# EAGLE design GlacTracker (EAGLE 9.6.2)

## Sheet 1 of 2
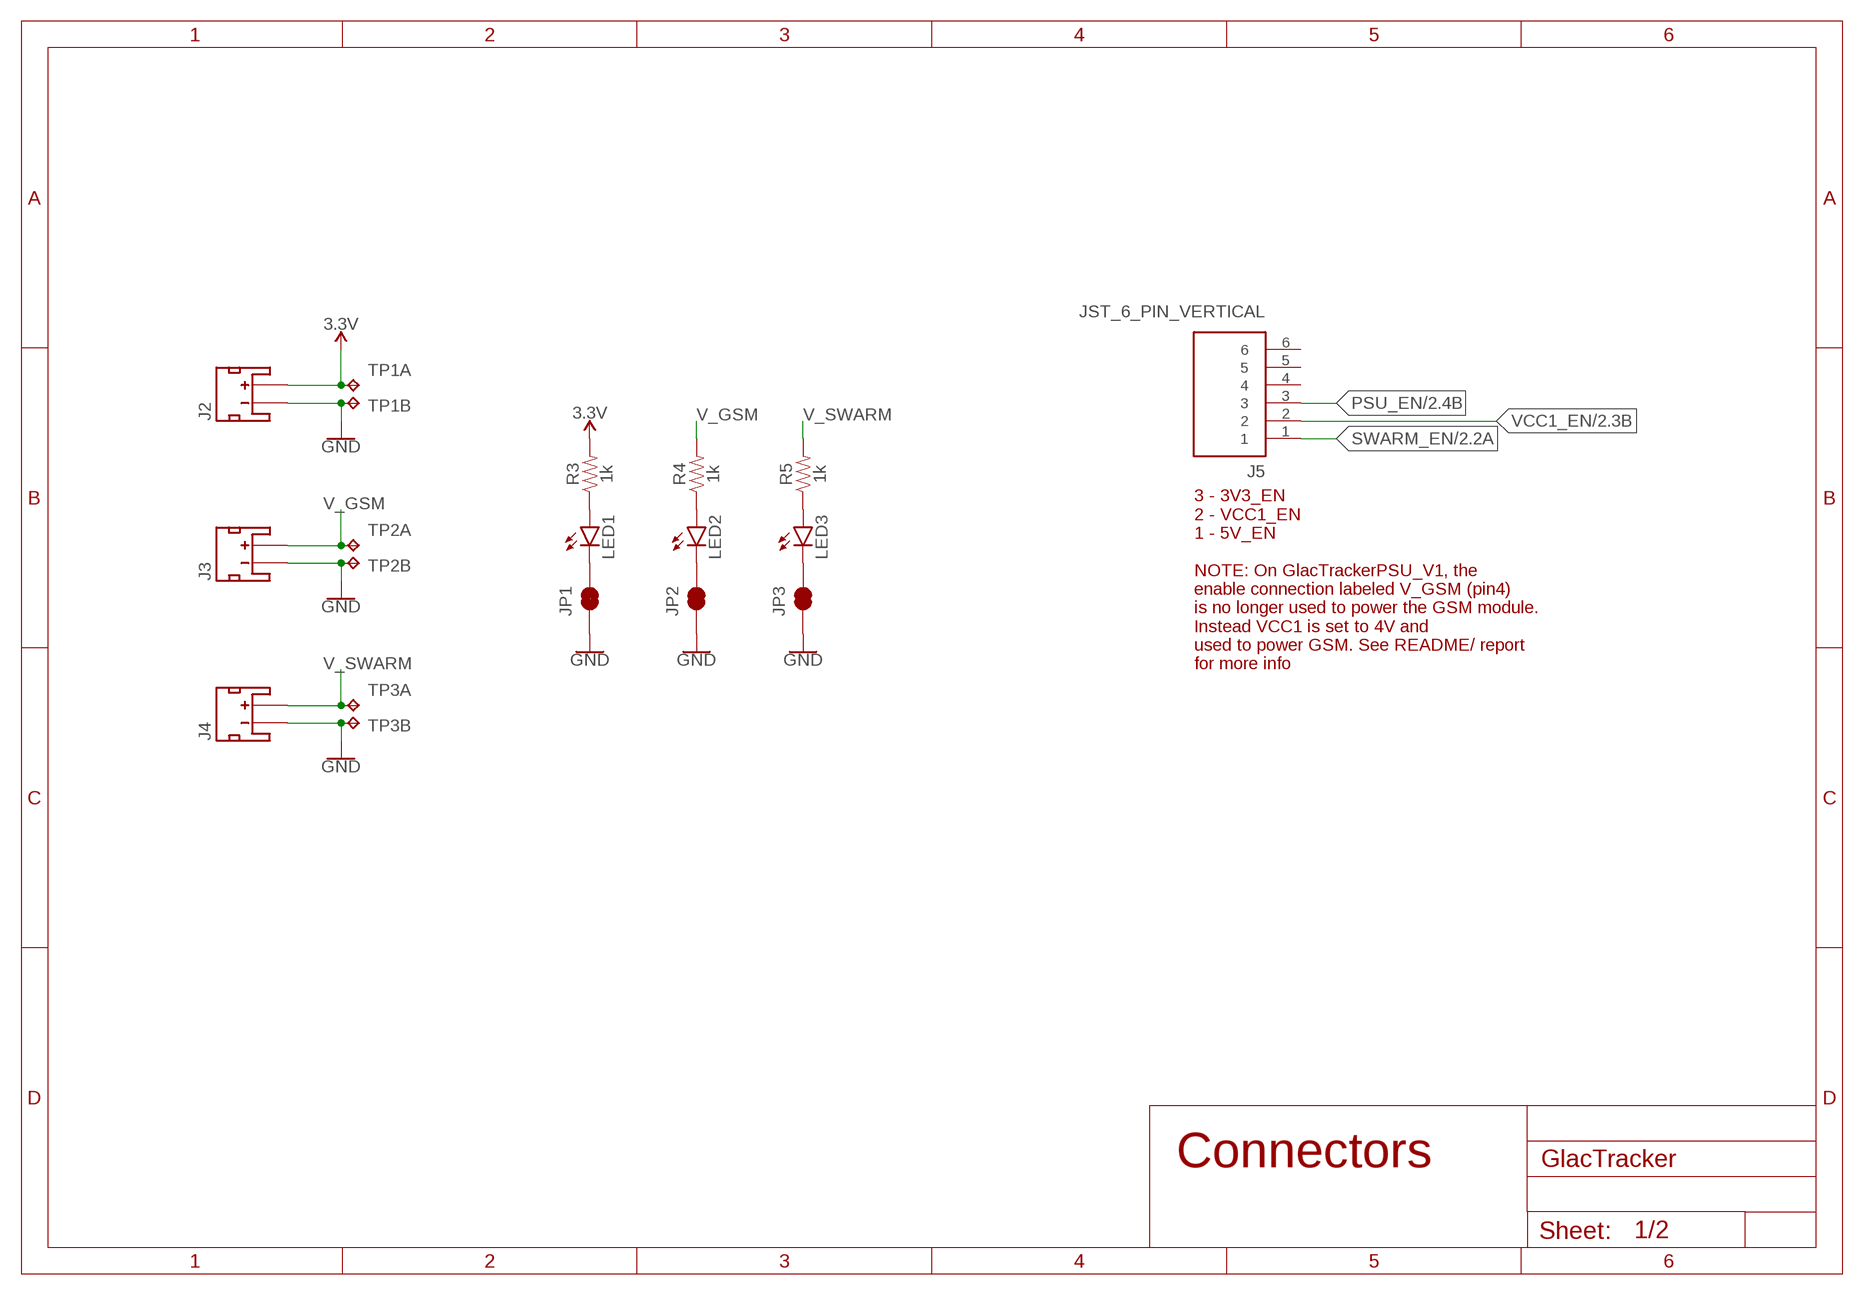
[diagram p0: schematic, sheet 1]

### Parts
J2  JST_2MM_MALE  [JST-2-SMD]
J3  JST_2MM_MALE  [JST-2-SMD]
J4  JST_2MM_MALE  [JST-2-SMD]
J5  JST_6_PIN_VERTICAL  [JST-6-SMD-VERT-1.0MM]
JP1  JUMPER-SMT_2_NC_TRACE_SILK  [SMT-JUMPER_2_NC_TRACE_SILK]
JP2  JUMPER-SMT_2_NC_TRACE_SILK  [SMT-JUMPER_2_NC_TRACE_SILK]
JP3  JUMPER-SMT_2_NC_TRACE_SILK  [SMT-JUMPER_2_NC_TRACE_SILK]
LED1  LEDCHIP-LED0805  [CHIP-LED0805]
LED2  LEDCHIP-LED0805  [CHIP-LED0805]
LED3  LEDCHIP-LED0805  [CHIP-LED0805]
R3  1k  RESISTOR0603  [0603]
R4  1k  RESISTOR0603  [0603]
R5  1k  RESISTOR0603  [0603]
TP1  TP2P2-38-17  [P2-38-17]
TP2  TP2P2-38-17  [P2-38-17]
TP3  TP2P2-38-17  [P2-38-17]

### Nets
3.3V: J2.2(+) R3.2 TP1.TP-1 ; also sheet 2
GND: J2.1(-) J3.1(-) J4.1(-) JP1.1 JP2.1 JP3.1 TP1.TP-2 TP2.TP-2 TP3.TP-2 ; also sheet 2
N$6: JP1.2 LED1.C
N$7: JP2.2 LED2.C
N$8: JP3.2 LED3.C
N$13: LED1.A R3.1
N$14: LED2.A R4.1
N$15: LED3.A R5.1
PSU_EN: J5.3 ; also sheet 2
SWARM_EN: J5.1 ; also sheet 2
V_GSM: J3.2(+) R4.2 TP2.TP-1 ; also sheet 2
V_SWARM: J4.2(+) R5.2 TP3.TP-1 ; also sheet 2
VCC1_EN: J5.2 ; also sheet 2
Unconnected: J2.NC1(PAD1) J2.NC2(PAD2) J3.NC1(PAD1) J3.NC2(PAD2) J4.NC1(PAD1) J4.NC2(PAD2) J5.4 J5.5 J5.6

### Notes on the sheet
- 3 - 3V3_EN
  2 - VCC1_EN
  1 - 5V_EN
  
  NOTE: On GlacTrackerPSU_V1, the 
  enable connection labeled V_GSM (pin4)
  is no longer used to power the GSM module.
  Instead VCC1 is set to 4V and 
  used to power GSM. See README/ report 
  for more info
- Connectors

## Sheet 2 of 2
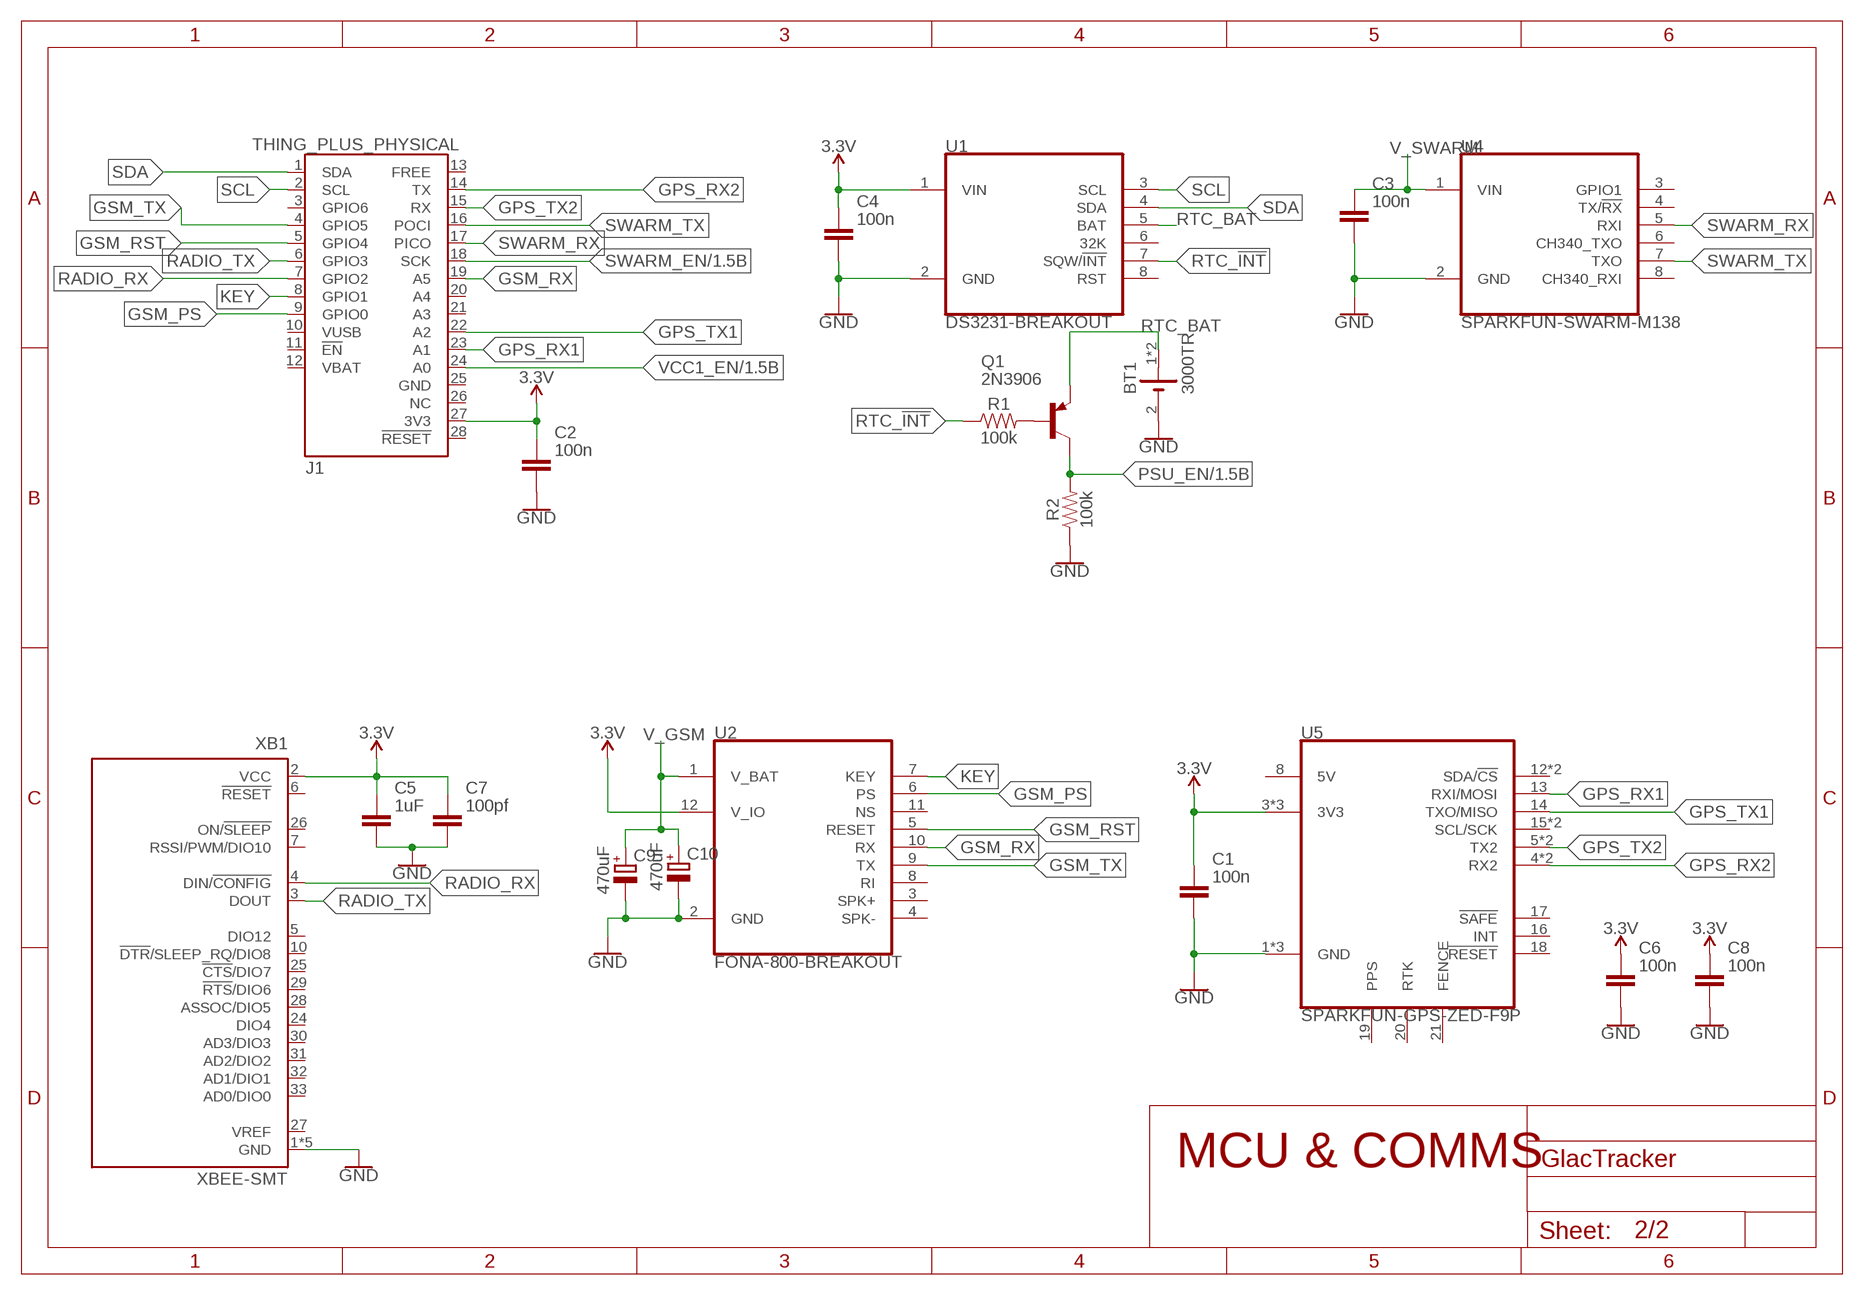
[diagram p1: schematic, sheet 2]

### Parts
BT1  3000TR  [BAT_3000TR]
C1  100n  C_CHIP-0603(1608-METRIC)  [CAPC1608X85]
C2  100n  C_CHIP-0603(1608-METRIC)  [CAPC1608X85]
C3  100n  C_CHIP-0603(1608-METRIC)  [CAPC1608X85]
C4  100n  C_CHIP-0603(1608-METRIC)  [CAPC1608X85]
C5  1uF  C_CHIP-0603(1608-METRIC)  [CAPC1608X85]
C6  100n  C_CHIP-0603(1608-METRIC)  [CAPC1608X85]
C7  100pf  C_CHIP-0603(1608-METRIC)  [CAPC1608X85]
C8  100n  C_CHIP-0603(1608-METRIC)  [CAPC1608X85]
C9  470uF  C-POL_RADIAL-11MM-DIA  [CAPPRD508W65D1000H1100B]
C10  470uF  C-POL_RADIAL-11MM-DIA  [CAPPRD508W65D1000H1100B]
J1  THING_PLUS_PHYSICAL  [THING_PLUS]
Q1  2N3906  [TO92]
R1  100k  RESISTOR0603  [0603]
R2  100k  RESISTOR0603  [0603]
U1  DS3231-BREAKOUT  [DS3231-BREAKOUT]
U2  FONA-800-BREAKOUT  [FONA-800-BREAKOUT]
U4  SPARKFUN-SWARM-M138  [SPARKFUN-SWARM-M138]
U5  SPARKFUN-GPS-ZED-F9P  [SPARKFUN-GPS-ZED-F9P]
XB1  XBEE-SMT  [XBEE-SMT]

### Nets
3.3V: C1.1 C2.1 C4.1 C5.1 C6.1 C7.1 C8.1 J1.27(3V3) U1.1(VIN) U2.12(V_IO) U5.3(3V3) U5.9(3V3) U5.24(3V3) XB1.2(VCC) ; also sheet 1
GND: BT1.2(-) C1.2 C2.2 C3.2 C4.2 C5.2 C6.2 C7.2 C8.2 C9.2(-) C10.2(-) R2.1 U1.2(GND) U2.2(GND) U4.2(GND) U5.1(GND) U5.7(GND) U5.25(GND) XB1.1(GND) XB1.11(GND) XB1.13(GND) XB1.22(GND) XB1.35(GND) ; also sheet 1
GPS_RX1: J1.23(A1) U5.13(RXI/MOSI)
GPS_RX2: J1.14(TX) U5.4(RX2) U5.11(RX2)
GPS_TX1: J1.22(A2) U5.14(TXO/MISO)
GPS_TX2: J1.15(RX) U5.5(TX2) U5.10(TX2)
GSM_PS: J1.9(GPIO0) U2.6(PS)
GSM_RST: J1.5(GPIO4) U2.5(RESET)
GSM_RX: J1.19(A5) U2.10(RX)
GSM_TX: J1.4(GPIO5) U2.9(TX)
KEY: J1.8(GPIO1) U2.7(KEY)
N$1: Q1.2(B) R1.2
PSU_EN: Q1.1(C) R2.2 ; also sheet 1
RADIO_RX: J1.7(GPIO2) XB1.4(DIN/!CONFIG)
RADIO_TX: J1.6(GPIO3) XB1.3(DOUT)
RTC_!INT: R1.1 U1.7(SQW/!INT)
RTC_BAT: BT1.1(+) BT1.3(+) Q1.3(E) U1.5(BAT)
SCL: J1.2(SCL) U1.3(SCL)
SDA: J1.1(SDA) U1.4(SDA)
SWARM_EN: J1.18(SCK) ; also sheet 1
SWARM_RX: J1.17(PICO) U4.5(RXI)
SWARM_TX: J1.16(POCI) U4.7(TXO)
V_GSM: C9.1(+) C10.1(+) U2.1(V_BAT) ; also sheet 1
V_SWARM: C3.1 U4.1(VIN) ; also sheet 1
VCC1_EN: J1.24(A0) ; also sheet 1
Unconnected: J1.3(GPIO6) J1.10(VUSB) J1.11(!EN) J1.12(VBAT) J1.13(FREE) J1.20(A4) J1.21(A3) J1.25(GND) J1.26(NC) J1.28(!RESET) U1.6(32K) U1.8(RST) U2.3(SPK+) U2.4(SPK-) U2.8(RI) U2.11(NS) U4.3(GPIO1) U4.4(TX/!RX) U4.6(CH340_TXO) U4.8(CH340_RXI) U5.8(5V) U5.12(SDA/!CS) U5.15(SCL/SCK) U5.16(INT) U5.17(!SAFE) U5.18(!RESET) U5.19(PPS) U5.20(RTK) U5.21(FENCE) U5.22(SCL/SCK) U5.23(SDA/!CS) XB1.5(DIO12) XB1.6(!RESET) XB1.7(RSSI/PWM/DIO10) XB1.10(!DTR!/SLEEP_RQ/DIO8) XB1.24(DIO4) XB1.25(!CTS!/DIO7) XB1.26(ON/!SLEEP) XB1.27(VREF) XB1.28(ASSOC/DIO5) XB1.29(!RTS!/DIO6) XB1.30(AD3/DIO3) XB1.31(AD2/DIO2) XB1.32(AD1/DIO1) XB1.33(AD0/DIO0)

### Notes on the sheet
- MCU & COMMS

## Library data of the parts
BT1 = 3000TR:3000TR: Ultra Low Profile SMT Coin Cell Battery Contact Retainer for 12 mm Cell Check availability <https://pricing.snapeda.com/parts/3000TR/Keystone/view-part?ref=eda>; AVAILABILITY: In Stock; DESCRIPTION: SMT Holder for 12mm Cell-Tin Nickel Plate on T&R; MF: Keystone; MP: 3000TR; PACKAGE: None; PRICE: None; PURCHASE-URL: https://pricing.snapeda.com/search/part/3000TR/?ref=eda
C1-C8 = Capacitor:C: Capacitor - Generic; CATEGORY: Capacitor
C9 C10 = Capacitor:C-POL: Capacitor Polarised - Generic; CATEGORY: Capacitor
J1 = SparkFun-Boards:THING_PLUS_PHYSICAL
J2-J4 = SparkFun-Connectors:JST_2MM_MALE: JST 2MM MALE RA CONNECTOR Two pin, compact surface mount connector. Commonly used as a battery input connection point. We really like the solid locking feeling and high current rating on these small connectors. We use these all the time as battery connectors. Mates to single-cell LiPo batteries. Here is the connector we sell at SparkFun: JST Right Angle Connector - White <https://www.sparkfun.com/products/8612> (PRT-08612) Datasheet <http://www.sparkfun.com/datasheets/Prototyping/Connectors/JST-Horizontal.pdf> It was used on these SparkFun products: SparkFun MOSFET Power Controller <https://www.sparkfun.com/products/11214> (PRT-11214) SparkFun Battery Babysitter - LiPo Battery Manager <https://www.sparkfun.com/products/13777> (PRT-13777) And many, many others that required a lipo battery connection.; PROD_ID: CONN-11443; SF_ID: PRT-08612
J5 = SparkFun-Connectors:JST_6_PIN_VERTICAL: JST 6 pin vertical connector Here is a six pin vertical 1.0mm pitch connector. It is useful if you need something very tiny as a connection. These are not the standard JST type connectors we use on most of our boards, but are actually the much smaller JST-SH type. Here is the connector we sell at SparkFun: JST SH Vertical 6-Pin Connector - SMD <https://www.sparkfun.com/products/579> (GPS-00579) Datasheet <http://www.sparkfun.com/datasheets/GPS/EM406-SMDConnector-eSH.pdf> It was used on these SparkFun products: SparkFun GPS Breakout <https://www.sparkfun.com/products/11818> (BOB-11818) SparkFun Weather Shield <https://www.sparkfun.com/products/12081> (DEV-12081) And many, many other GPS related products.; PROD_ID: CONN-08249; SF_ID: GPS-00579
JP1-JP3 = SparkFun-Jumpers:JUMPER-SMT_2_NC_TRACE: Normally closed trace jumper This jumper has a trace between two pads so it's normally closed (NC). Use a razor knife to open the connection. For best results follow the IPC guidelines for cutting traces: Cutout at least 0.063 mm (0.005 in). Remove all loose material to clean up the cut area. Seal the cut with an approved epoxy. Reapply solder to reclose the connection.
LED1-LED3 = led:LED: LED OSRAM: - CHIPLED LG R971, LG N971, LY N971, LG Q971, LY Q971, LO R971, LY R971 LH N974, LH R974 LS Q976, LO Q976, LY Q976 LO Q996 - Hyper CHIPLED LW Q18S LB Q993, LB Q99A, LB R99A - SideLED LS A670, LO A670, LY A670, LG A670, LP A670 LB A673, LV A673, LT A673, LW A673 LH A674 LY A675 LS A676, LA A676, LO A676, LY A676, LW A676 LS A679, LY A679, LG A679 - Hyper Micro SIDELED® LS Y876, LA Y876, LO Y876, LY Y876 LT Y87S - SmartLED LW L88C, LW L88S LB L89C, LB L89S, LG L890 LS L89K, LO L89K, LY L89K LS L896, LA L896, LO L896, LY L896 - TOPLED LS T670, LO T670, LY T670, LG T670, LP T670 LSG T670, LSP T670, LSY T670, LOP T670, LYG T670 LG T671, LOG T671, LSG T671 LB T673, LV T673, LT T673, LW T673 LH T674 LS T676, LA T676, LO T676, LY T676, LB T676, LH T676, LSB T676, LW T676 LB T67C, LV T67C, LT T67C, LS T67K, LO T67K, LY T67K, LW E67C LS E67B, LA E67B, LO E67B, LY E67B, LB E67C, LV E67C, LT E67C LW T67C LS T679, LY T679, LG T679 LS T770, LO T770, LY T770, LG T770, LP T770 LB T773, LV T773, LT T773, LW T773 LH T774 LS E675, LA E675, LY E675, LS T675 LS T776, LA T776, LO T776, LY T776, LB T776 LHGB T686 LT T68C, LB T68C - Hyper Mini TOPLED® LB M676 - Mini TOPLED Santana® LG M470 LS M47K, LO M47K, LY M47K Source: http://www.osram.convergy.de LUXEON: - LUMILED® LXK2-PW12-R00, LXK2-PW12-S00, LXK2-PW14-U00, LXK2-PW14-V00 LXK2-PM12-R00, LXK2-PM12-S00, LXK2-PM14-U00 LXK2-PE12-Q00, LXK2-PE12-R00, LXK2-PE12-S00, LXK2-PE14-T00, LXK2-PE14-U00 LXK2-PB12-K00, LXK2-PB12-L00, LXK2-PB12-M00, LXK2-PB14-N00, LXK2-PB14-P00, LXK2-PB14-Q00 LXK2-PR12-L00, LXK2-PR12-M00, LXK2-PR14-Q00, LXK2-PR14-R00 LXK2-PD12-Q00, LXK2-PD12-R00, LXK2-PD12-S00 LXK2-PH12-R00, LXK2-PH12-S00 LXK2-PL12-P00, LXK2-PL12-Q00, LXK2-PL12-R00 Source: www.luxeon.com KINGBRIGHT: KA-3528ASYC Source: www.kingbright.com
Q1 = transistor-pnp:2N3906: PNP Transistor
R1-R5 = SparkFun-Resistors:RESISTOR: Generic Resistor Package
TP1-TP3 = testpad:TP2: Test pad
U1 = GlacTracker:DS3231-BREAKOUT
U2 = GlacTracker:FONA-800-BREAKOUT
U4 = GlacTracker:SPARKFUN-SWARM-M138
U5 = GlacTracker:SPARKFUN-GPS-ZED-F9P
XB1 = xbee:XBEE-SMT: XBee(TM)/XBee-PRO(TM) ZB SMT RF Modules. Source: Digi (90002002_a.pdf) (http://www.digi.com/products/wireless-wired-embedded-solutions/zigbee-rf-modules/zigbee-mesh-module/xbee-smt.jsp#overview)

## Board
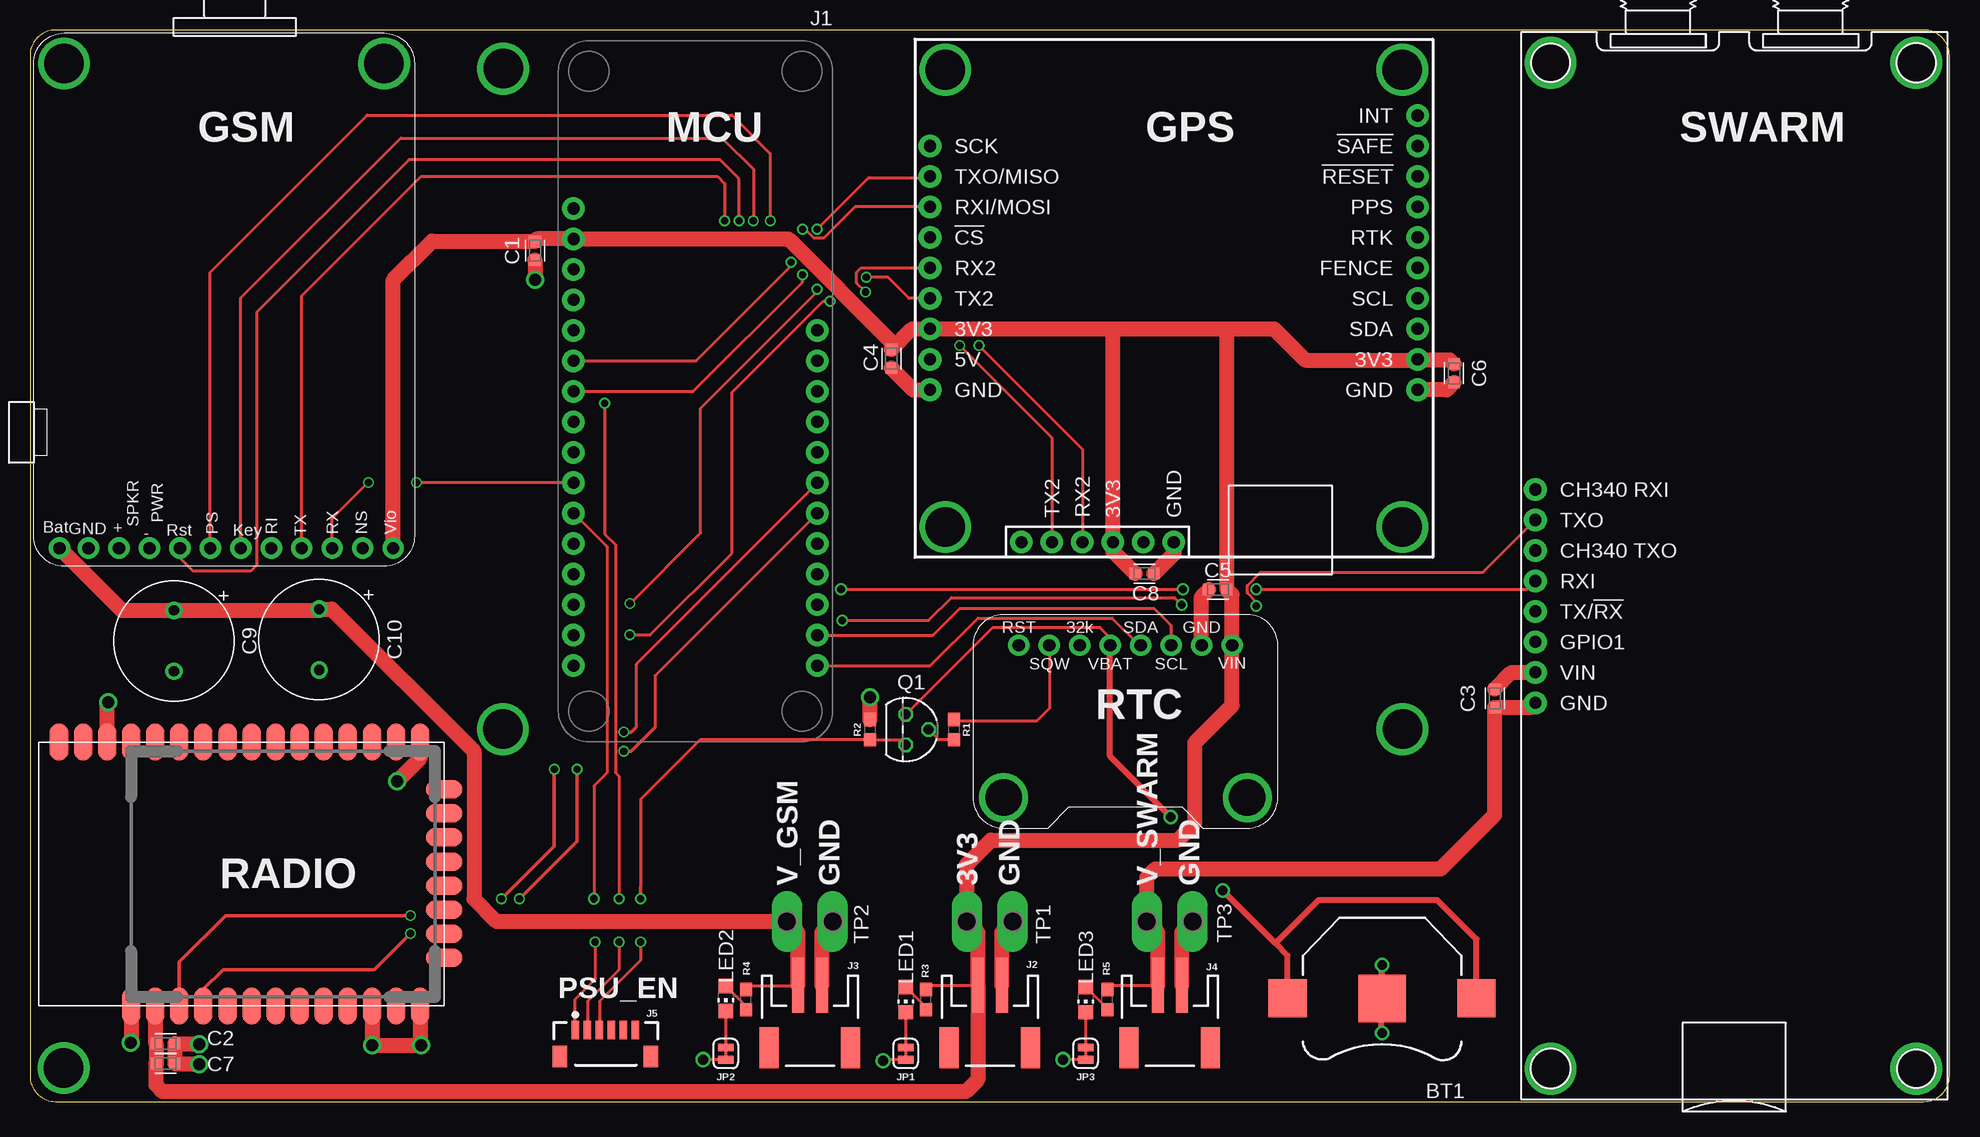
[diagram p2: board, top side]
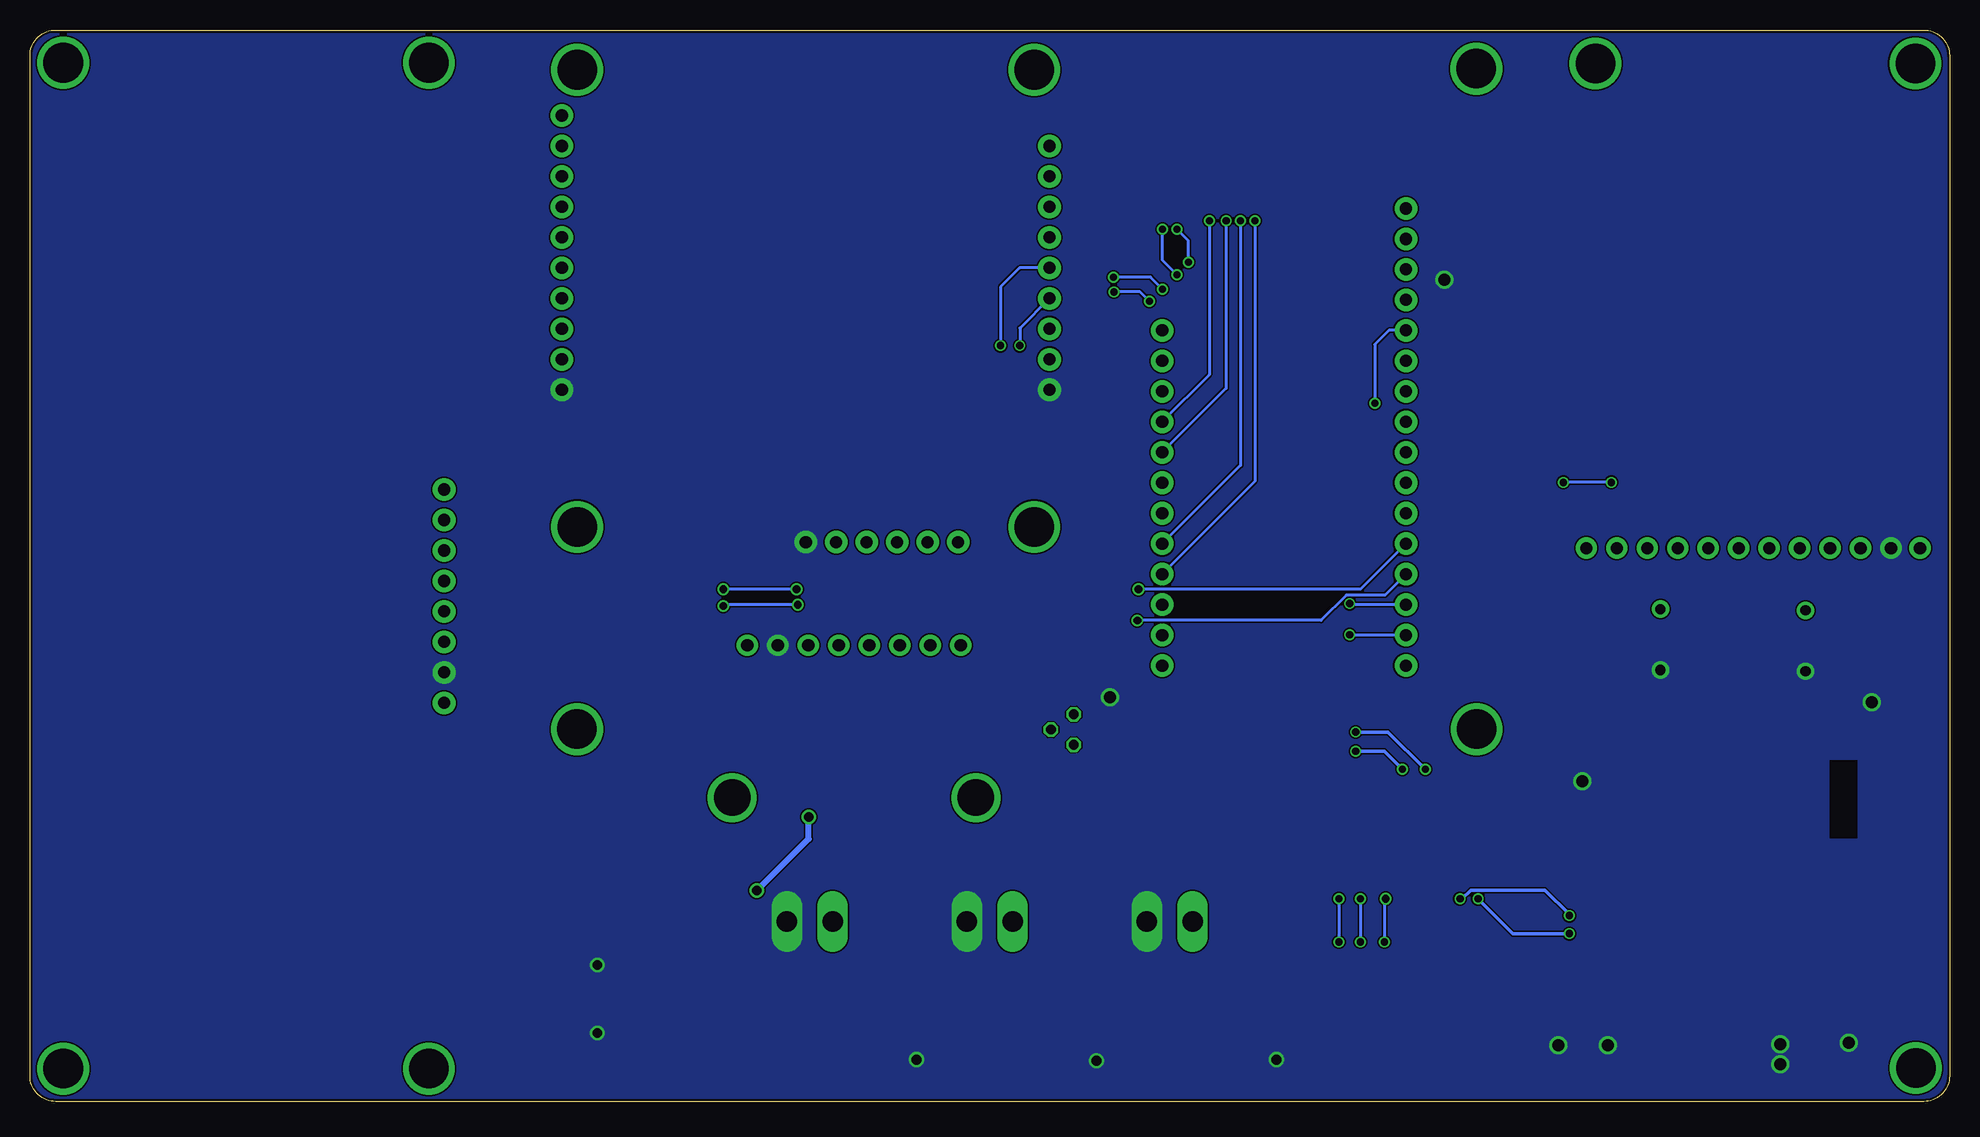
[diagram p3: board, bottom side, seen from below]

Size 160 x 89.3 mm. Coordinates in mm from the lower left corner, seen from the top.
Outline: 0,87.15 0,2.15 arc90 2.15,0 157.85,0 arc90 160,2.15 160,87.15 arc90 157.85,89.3 2.15,89.3 arc90 0,87.15
Copper layers (1*16): Top 0.035559375mm / dielectric 1.6mm / Bottom 0.035559375mm
Design rules "jlcpcb2layer": minimum track width 5mil, minimum drill 12mil, track to track 5mil, track to pad 5mil, pad to pad 5mil, via to via 5mil, smd to smd 5mil, copper to edge 8mil, drill to drill 6mil, minimum pad ring 5mil, minimum via ring 3mil, stop-mask expansion 2.5mil, vias tented up to drill 0mil, thermal gap 10mil
bRestrict: area 7.7,22 to 10,28.4

### Footprints (pad centres in the part's own frame; a part is rotated, then mirrored left to right if it is on the bottom)
BAT_3000TR = smd 3.18 x 3.18: 1 -7.87,0; 3 7.87,0 | smd 3.96 x 3.96: 2 0,0
CAPC1608X85 = smd 0.921 x 0.97: 1 -0.775,0; 2 0.775,0
CAPPRD508W65D1000H1100B = drill 0.85 pad 1.45: 1 -2.54,0; 2 2.54,0
THING_PLUS = drill 1.016 pad 1.88: 1 1.27,52.07; 2 1.27,49.53; 3 1.27,46.99; 4 1.27,44.45; 5 1.27,41.91; 6 1.27,39.37; 7 1.27,36.83; 8 1.27,34.29; 9 1.27,31.75; 10 1.27,29.21; 11 1.27,26.67; 12 1.27,24.13; 13 21.59,52.07; 14 21.59,49.53; 15 21.59,46.99; 16 21.59,44.45; 17 21.59,41.91; 18 21.59,39.37; 19 21.59,36.83; 20 21.59,34.29; 21 21.59,31.75; 22 21.59,29.21; 23 21.59,26.67; 24 21.59,24.13; 25 21.59,21.59; 26 21.59,19.05; 27 21.59,16.51; 28 21.59,13.97
JST-2-SMD = smd 1 x 4.6: 1 -1,-3.7; 2 1,-3.7 | smd 1.6 x 3.4: NC1 -3.4,1.5; NC2 3.4,1.5
JST-6-SMD-VERT-1.0MM = smd 0.6 x 1.55: 1 -2.54,1.27; 2 -1.54,1.27; 3 -0.54,1.27; 4 0.46,1.27; 5 1.46,1.27; 6 2.46,1.27 | smd 1.2 x 1.8: P$1 -3.84,-0.955; P$2 3.76,-0.955
SMT-JUMPER_2_NC_TRACE_SILK = smd 0.635 x 1.27: 1 -0.508,0; 2 0.508,0
CHIP-LED0805 = smd 1.2 x 1.2: A 0,-1.05; C 0,1.05
TO92 = drill 0.813 octagon: 1 1.27,0; 2 0,1.905; 3 -1.27,0
0603 = smd 1.1 x 1: 1 -0.85,0; 2 0.85,0
P2-38-17 = drill 1.702 pad 2.121 long: TP-1 -1.905,0; TP-2 1.905,0
DS3231-BREAKOUT = drill 1.016 pad 1.778: 1 3.81,2.54; 2 6.35,2.54; 3 8.89,2.54; 4 11.43,2.54; 5 13.97,2.54; 6 16.51,2.54; 7 19.05,2.54; 8 21.59,2.54 | drill 3.048: P$9 2.54,15.24; P$10 22.86,15.24
FONA-800-BREAKOUT = drill 1.016 pad 1.778: 1 2.159,1.524; 2 4.572,1.524; 3 7.112,1.524; 4 9.652,1.524; 5 12.192,1.524; 6 14.732,1.524; 7 17.272,1.524; 8 19.812,1.524; 9 22.352,1.524; 10 24.892,1.524; 11 27.432,1.524; 12 29.972,1.524 | drill 3.302: P$1 2.54,41.91; P$2 29.21,41.91
SPARKFUN-SWARM-M138 = drill 1.016 pad 1.88: 1 1.27,33.02; 2 1.27,35.56; 3 1.27,38.1; 4 1.27,40.64; 5 1.27,43.18; 6 1.27,45.72; 7 1.27,48.26; 8 1.27,50.8 | drill 3.302: 9 2.54,86.36; 10 33.02,86.36; 11 2.54,2.54; 12 33.02,2.54
SPARKFUN-GPS-ZED-F9P = drill 1.016 pad 1.88: 1 1.27,21.59; 2 1.27,24.13; 3 1.27,26.67; 4 1.27,29.21; 5 1.27,31.75; 6 1.27,34.29; 7 13.97,41.91; 8 16.51,41.91; 9 19.05,41.91; 10 21.59,41.91; 11 24.13,41.91; 12 26.67,41.91; 13 29.21,41.91; 14 31.75,41.91; 15 34.29,41.91; 16 36.83,1.27; 17 34.29,1.27; 18 31.75,1.27; 19 29.21,1.27; 20 26.67,1.27; 21 24.13,1.27; 22 21.59,1.27; 23 19.05,1.27; 24 16.51,1.27; 25 13.97,1.27 | drill 3.302: P$1 2.54,40.64; P$2 40.64,40.64; P$3 40.64,2.54; P$4 2.54,2.54
XBEE-SMT = smd 3.048 x 1.524: 1 0,26.086; 2 0,24.079; 3 0,22.073; 4 0,20.066; 5 0,18.059; 6 0,16.053; 7 0,14.046; 8 0,12.04; 9 0,10.033; 10 0,8.026; 11 0,6.02; 12 0,4.013; 13 0,2.007; 22 21.996,2.007; 23 21.996,4.013; 24 21.996,6.02; 25 21.996,8.026; 26 21.996,10.033; 27 21.996,12.04; 28 21.996,14.046; 29 21.996,16.053; 30 21.996,18.059; 31 21.996,20.066; 32 21.996,22.073; 33 21.996,24.079; 34 21.996,26.086; 35 21.996,28.092; 36 21.996,30.099; 37 21.996,32.106 | smd 1.524 x 3.048: 14 4.013,0; 15 6.02,0; 16 8.026,0; 17 10.033,0; 18 12.04,0; 19 14.046,0; 20 16.053,0; 21 18.059,0

### Placement (x,y rotation side)
BT1  112.7,8.6 180 top
C1  42.1,70.9 270 top
C2  11.29,4.84 0 top
C3  122.1,33.6 90 top
C4  71.8,61.9 270 top
C5  99.01,42.67 180 top
C6  118.7,60.7 270 top
C7  11.3,3.17 0 top
C8  92.9,44 0 top
C9  12,38.4 270 top
C10  24.1,38.5 270 top
J1  66.9,88.4 180 top
J2  80,6 180 top
J3  65,6 180 top
J4  95,6 180 top
J5  48,4.7 0 top
JP1  73,4 90 top
JP2  58,4 90 top
JP3  88,4 90 top
LED1  73,8.5 180 top
LED2  58,8.6 180 top
LED3  88,8.5 180 top
Q1  73,31 270 top
R1  77,31 270 top
R2  70,31 270 top
R3  74.7,8.5 90 top
R4  59.7,8.5 90 top
R5  89.8,8.5 90 top
TP1  80,15 0 top
TP2  65,15 0 top
TP3  95,15 0 top
U1  104.01,40.57 180 top
U2  0.3,44.6 0 top
U4  124.21,0.21 0 top
U5  116.93,45.35 90 top
XB1  34.52,7.97 90 top

### Tracks (layer width: path | path; a pad name or v marks a point on that pad's centre or on a via)
3.3V
  Top 0.254: R3.2 75.05,9.7 J2.2
  Top 1.27: 90.2,64.4 U5.9 73.53,64.4 C4.1 71.8,63.3 63.21,71.89 J1.27 42.27,71.89 42.08,71.7 | 90.2,64.4 99.9,64.4 | 99.9,64.4 103.7,64.4 106.3,61.8 115.6,61.8 | 115.6,61.8 U5.24 | 90.2,64.4 90.26,64.34 U5.3 90.26,45.87 C8.1 | U2.12 30.27,68.47 33.5,71.7 42.08,71.7 | 42.08,71.7 C1.1 | C6.1 118.38,61.8 115.6,61.8 | XB1.2 10.44,4.91 C2.1 10.52,3.19 | 10.52,3.19 C7.1 | 10.52,3.19 10.5,3.17 10.5,1.4 11.06,0.84 78,0.84 79,1.84 J2.2 79,14.1 TP1.TP-1 78.09,19.8 80.1,21.8 95.7,21.8 97.1,23.2 97.1,29.9 100.2,33 U1.1 100.2,42.25 C5.1 99.79,64.29 99.9,64.4
GND  (via drill 0.8, 0.85, 1)
  Top 0.254: v56.1,3.5 v56.11,3.49 JP2.1 | v86.1,3.5 v86.11,3.49 JP3.1 | JP1.1 71.19,3.49 v71.1,3.4
  Top 0.508: v112.7,11.4 BT1.2 112.6,8.5 112.6,5.8 v112.7,5.7
  Top 1.27: U5.1 95.34,45.66 C8.2 | C3.2 123.5,35.77 U4.2 | C1.2 v42.1,68.5 | C4.2 73.61,59.32 U5.7 | C6.2 118.09,59.32 U5.25 | U1.2 97.66,42.09 C5.2 | R2.1 v70,33.7 | J3.1 66,14.1 TP2.TP-2 | J2.1 81,14.1 TP1.TP-2 | J4.1 96,14.1 TP3.TP-2 | XB1.35 6.43,33.23 v6.5,33.3 | XB1.22 32.52,28.61 v30.6,26.7 | XB1.13 32.52,4.79 | 32.52,4.79 v32.6,4.7 | XB1.11 v28.5,4.7 32.43,4.7 32.52,4.79 | v14.1,4.8 14.06,4.84 C2.2 12.08,4.83 C7.2 14.03,3.17 v14.1,3.1 | XB1.1 8.44,4.94 v8.4,4.9
  pour Bottom (no thermals): 0,0 160,0 160,89.2 0,89.2
GPS_RX1  (via drill 0.6)
  Top 0.254: J1.23 55.53,61.73 63.44,69.64 v63.44,69.94 | v64.4,72.7 64.6,72.7 65.31,72 66.2,72 68.8,74.6 74.98,74.6 U5.13
  Bottom 0.254: v63.44,69.94 63.44,71.74 v64.4,72.7
GPS_RX2  (via drill 0.6)
  Top 0.254: v50,38.9 51.7,38.9 58.5,45.7 58.5,59.1 66.09,66.69 v66.69,66.69 | v69.64,67.47 68.9,68.21 68.9,69.1 69.28,69.48 U5.11 | v79.1,63 87.72,54.38 U5.4
  Bottom 0.254: J1.14 49.97,38.87 v50,38.9 | v66.69,66.69 67.47,67.47 v69.64,67.47 | U5.11 77.52,69.48 79.1,67.9 v79.1,63
GPS_TX1  (via drill 0.6)
  Top 0.254: J1.22 55.29,59.19 64.4,68.3 v64.4,68.9 | v65.6,72.7 69.9,77 74.92,77 U5.14
  Bottom 0.254: v64.4,68.9 65.6,70.1 v65.6,72.7
GPS_TX2  (via drill 0.6)
  Top 0.254: v50,41.5 55.9,47.4 55.9,57.8 65.6,67.5 v65.6,67.7 | U5.10 73.26,66.94 71.5,68.7 v69.7,68.7 | v77.5,63 85.18,55.32 U5.5
  Bottom 0.254: J1.15 49.91,41.41 v50,41.5 | v65.6,67.7 66.6,68.7 v69.7,68.7 | U5.10 77.5,64.46 v77.5,63
GSM_PS  (via drill 0.6)
  Top 0.254: U2.6 15.03,69.13 28.1,82.2 58.5,82.2 61.7,79 v61.7,73.4
  Bottom 0.254: v61.7,73.4 61.7,60.58 J1.9
GSM_RST  (via drill 0.6)
  Top 0.254: v59.1,73.4 59.1,76.9 57.5,78.5 31.6,78.5 18.9,65.8 18.9,44.7 18.4,44.2 13.6,44.2 12.49,45.31 U2.5
  Bottom 0.254: v59.1,73.4 59.1,53.02 J1.5
GSM_RX  (via drill 0.6)
  Top 0.254: U2.10 25.19,48.59 v28.2,51.6 | v32.2,51.6 45.28,51.6 J1.19
  Bottom 0.254: v28.2,51.6 v32.2,51.6
GSM_TX  (via drill 0.6)
  Top 0.254: U2.9 22.65,67.15 32.6,77.1 57.3,77.1 57.9,76.5 v57.9,73.4
  Bottom 0.254: v57.9,73.4 57.9,51.68 J1.4
KEY  (via drill 0.6)
  Top 0.254: U2.7 17.57,66.97 30.9,80.3 57.7,80.3 60.3,77.7 v60.3,73.4
  Bottom 0.254: v60.3,73.4 60.3,59.44 J1.8
N$1
  Top 0.254: R1.2 75.75,30.15 Q1.2
N$3  (via drill 3.3)
  other vias: 2.8,2.8
N$4  (via drill 3.3)
  other vias: 39.45,86.08
N$6
  Top 0.254: JP1.2 LED1.C
N$7
  Top 0.254: JP2.2 LED2.C
N$8
  Top 0.254: JP3.2 LED3.C
N$11  (via drill 3.3)
  other vias: 114.4,31.04
N$12  (via drill 3.3)
  other vias: 39.42,31.04
N$13
  Top 0.254: LED1.A 74.7,7.85 R3.1
N$14
  Top 0.254: LED2.A 58.95,8.7 59.7,7.94 R4.1
N$15
  Top 0.254: LED3.A 89.8,7.75 R5.1
PSU_EN  (via drill 0.6)
  Top 0.254: 50.9,17.9 50.9,25.2 55.85,30.15 R2.2 72.58,30.15 Q1.1 | v50.9,13.3 50.9,11.8 47.46,8.36 J5.3
  Top 0.305: 50.9,17.9 v50.9,16.9
  Bottom 0.254: v50.9,16.9 v50.9,13.3
RADIO_RX  (via drill 0.6)
  Top 0.254: J1.7 50.5,36.44 50.5,31.2
  Top 0.305: 50.5,31.2 50.1,30.8 v49.5,30.8 | v43.7,27.7 43.7,21.3 v39.3,16.9 | v31.7,14 28.7,11 16.1,11 14.46,9.36 XB1.4
  Bottom 0.305: v49.5,30.8 46.8,30.8 v43.7,27.7 | v39.3,16.9 36.4,14 v31.7,14
RADIO_TX  (via drill 0.6)
  Top 0.254: J1.6 52.1,35.5 52.1,31.2
  Top 0.305: 52.1,31.2 50.1,29.2 v49.5,29.2 | v45.6,27.7 45.6,21.7 v40.8,16.9 | v31.7,15.5 16.3,15.5 12.45,11.65 XB1.3
  Bottom 0.305: v49.5,29.2 47.1,29.2 v45.6,27.7 | v40.8,16.9 40.63,16.9 39.9,17.63 33.73,17.63 31.7,15.6 v31.7,15.5
RTC_!INT
  Top 0.254: U1.7 84.96,32.76 83.9,31.7 77.15,31.7 R1.1
RTC_BAT  (via drill 0.8)
  Top 0.254: U1.5 90.04,38.66 89.2,39.5 80.23,39.5 Q1.3
  Top 0.508: BT1.3 104.83,12.17 103.8,13.2 | 103.8,13.2 v99.4,17.6 | v95.1,23.7 90.04,28.76 U1.5 | BT1.1 120.57,13.53 117.3,16.8 107.4,16.8 103.8,13.2
  Bottom 0.508: v99.4,17.6 95.1,21.9 v95.1,23.7
SCL
  Top 0.254: J1.2 75.27,38.87 77.5,41.1 93.7,41.1 95.12,39.68 U1.3
SDA
  Top 0.254: J1.1 75.03,36.33 79,40.3 90.2,40.3 92.47,38.03 U1.4
SWARM_EN  (via drill 0.6, 0.65)
  Top 0.254: v47,16.9 47,26.3 48.1,27.41 48.1,46.24 J1.18 | v47.1,13.3 47.1,10.2 45.4,8.5 45.4,6.03 J5.1
  Bottom 0.254: v47,16.9 47.1,16.8 v47.1,13.3
SWARM_RX  (via drill 0.65)
  Top 0.254: v67.6,42.7 v96.1,42.7 | v102.2,42.7 124.79,42.7 U4.5
  Bottom 0.254: J1.17 49.1,42.7 v67.6,42.7 | v96.1,42.7 v102.2,42.7
SWARM_TX  (via drill 0.65)
  Top 0.254: v67.7,40.1 74.9,40.1 76.8,42 95.4,42 v96,41.4 | v102.2,41.3 102.2,41.65 101.46,42.39 101.46,43.01 102.55,44.1 121.11,44.1 U4.7
  Bottom 0.254: J1.16 47.06,42.2 50.29,42.2 52.4,40.1 v67.7,40.1 | v96,41.4 102.2,41.4 v102.2,41.3
V_GSM
  Top 0.254: J3.2 63.95,9.65 60,9.65 R4.2
  Top 1.27: J3.2 64,14.1 TP2.TP-1 38.9,15 37,16.9 37,29.2 25.16,41.04 C10.1 24,40.94 C9.1 7.64,40.94 U2.1
V_SWARM
  Top 0.254: R5.2 90.15,9.7 J4.2
  Top 1.27: U4.1 125.08,32.83 C3.1 122.1,23.9 117.6,19.4 93.8,19.4 93.09,18.7 TP3.TP-1 94,14.1 J4.2
VCC1_EN  (via drill 0.6)
  Top 0.254: v47.9,58.2 47.9,47.3 48.8,46.4 48.8,27.41 49.1,27.11 v49.1,16.9 | v49.1,13.3 49.1,11 46.46,8.36 J5.2
  Bottom 0.254: J1.24 46.73,64.27 47.9,63.1 v47.9,58.2 | v49.1,16.9 v49.1,13.3

### Text on the board
tPlace: GSM | MCU | GPS | SWARM | RTC | RADIO | V_GSM | GND | 3V3 | GND | V_SWARM | GND | PSU_EN
Document: GND | V_IN | GND | V_BATT | 5V | GND | GND | GND | GND | GND | VCC_2 | VCC_1 | 3.3V | V_GSM